# EasyEDA schematic SCH.json

## Sheets
1 CONNECTOR
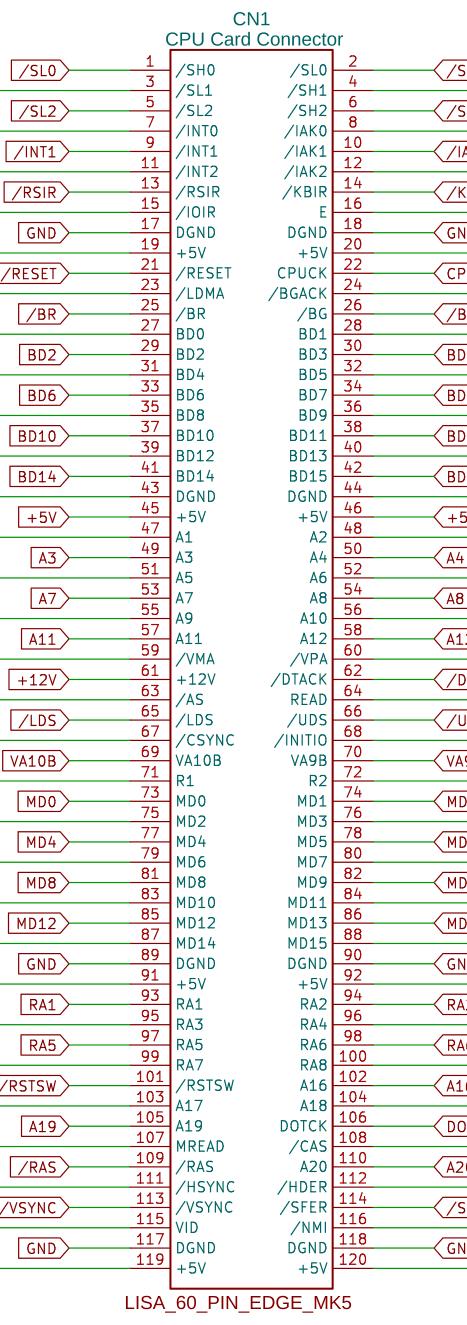
[diagram p0: CONNECTOR]
2 CPU
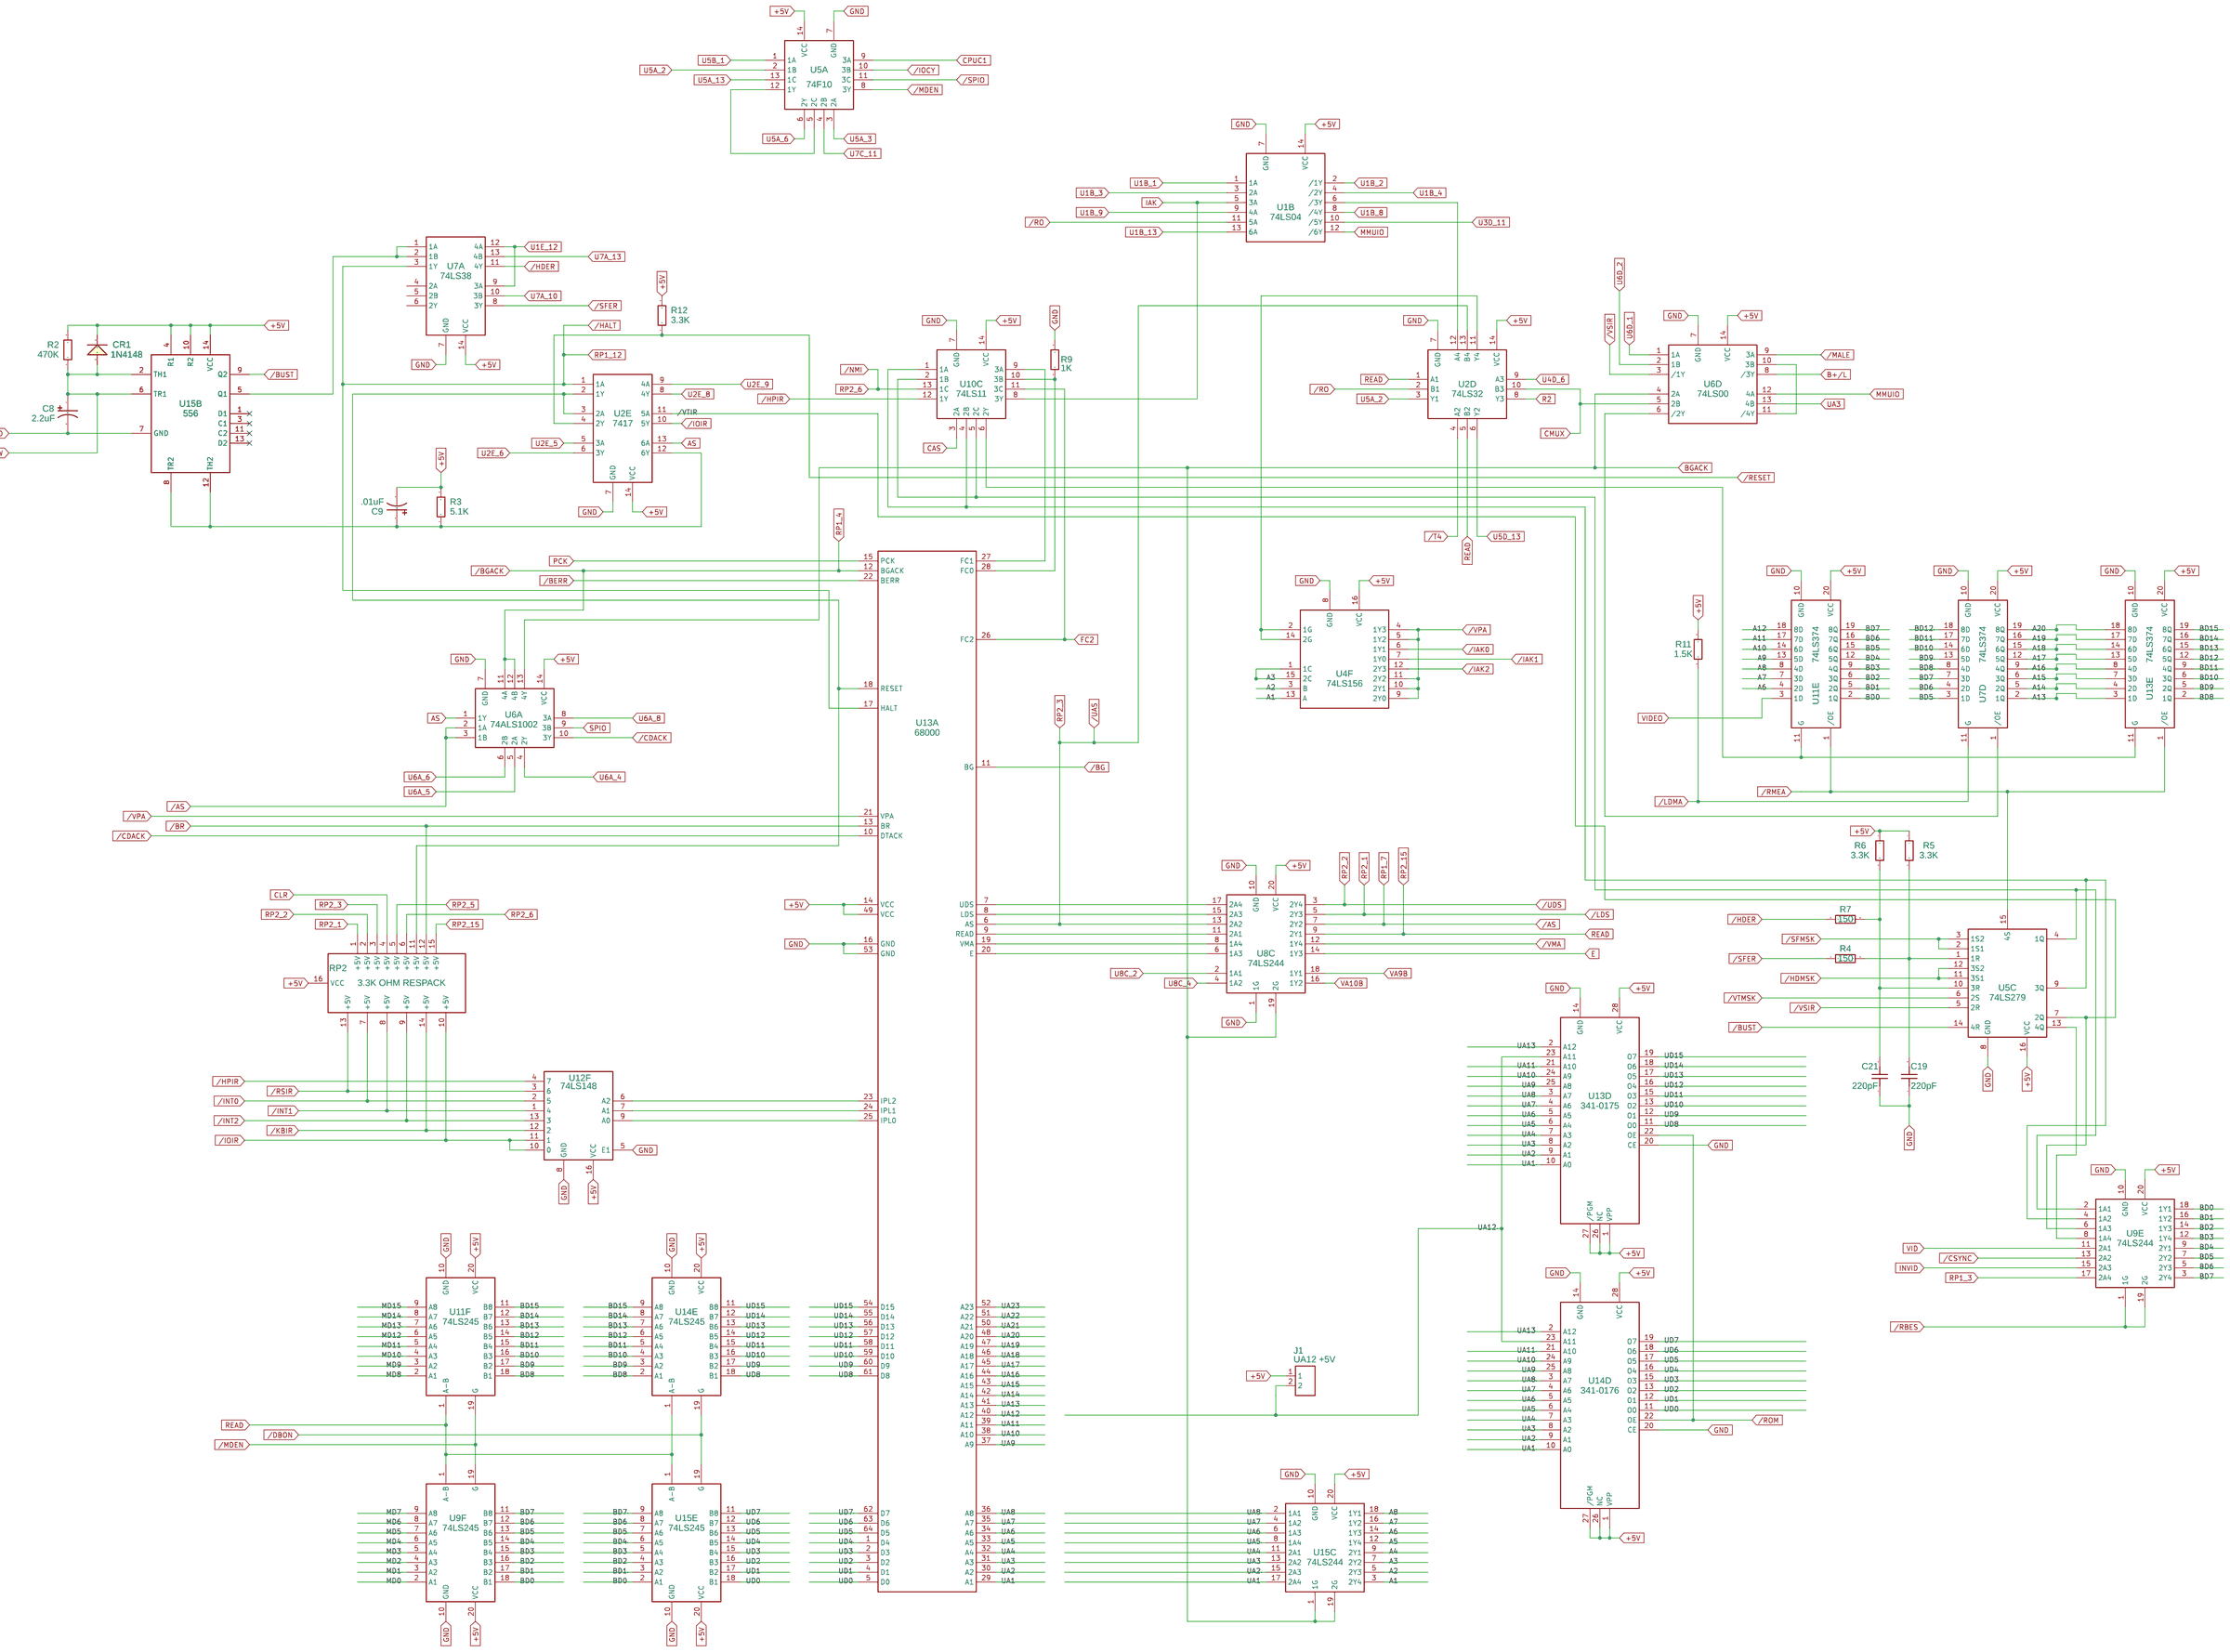
[diagram p1: CPU]
3 MMU
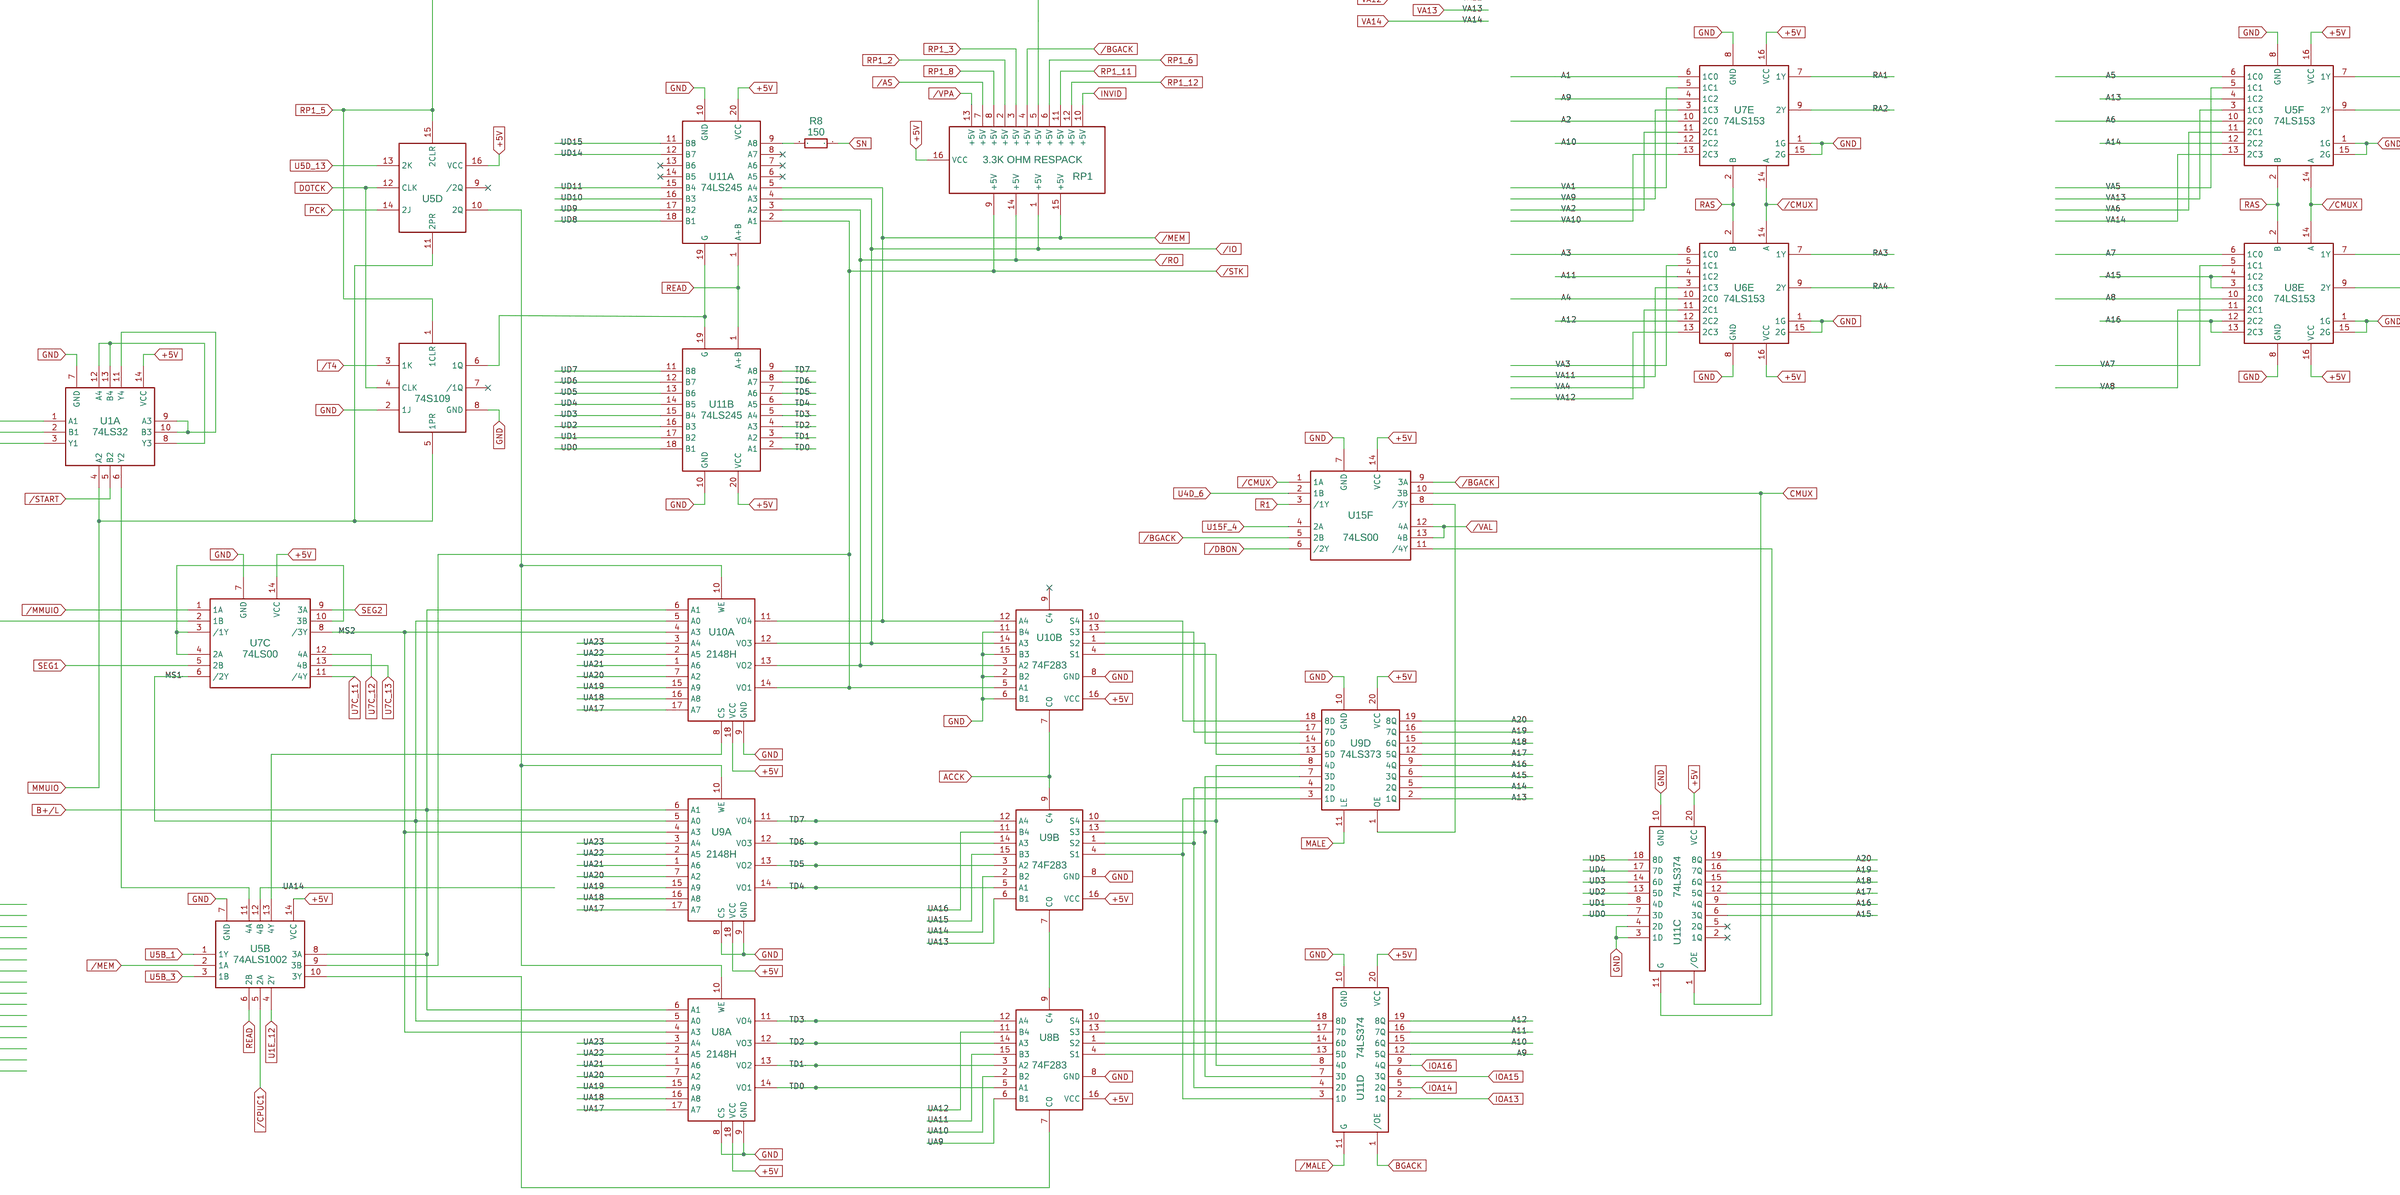
[diagram p2: MMU]
4 VIDEO
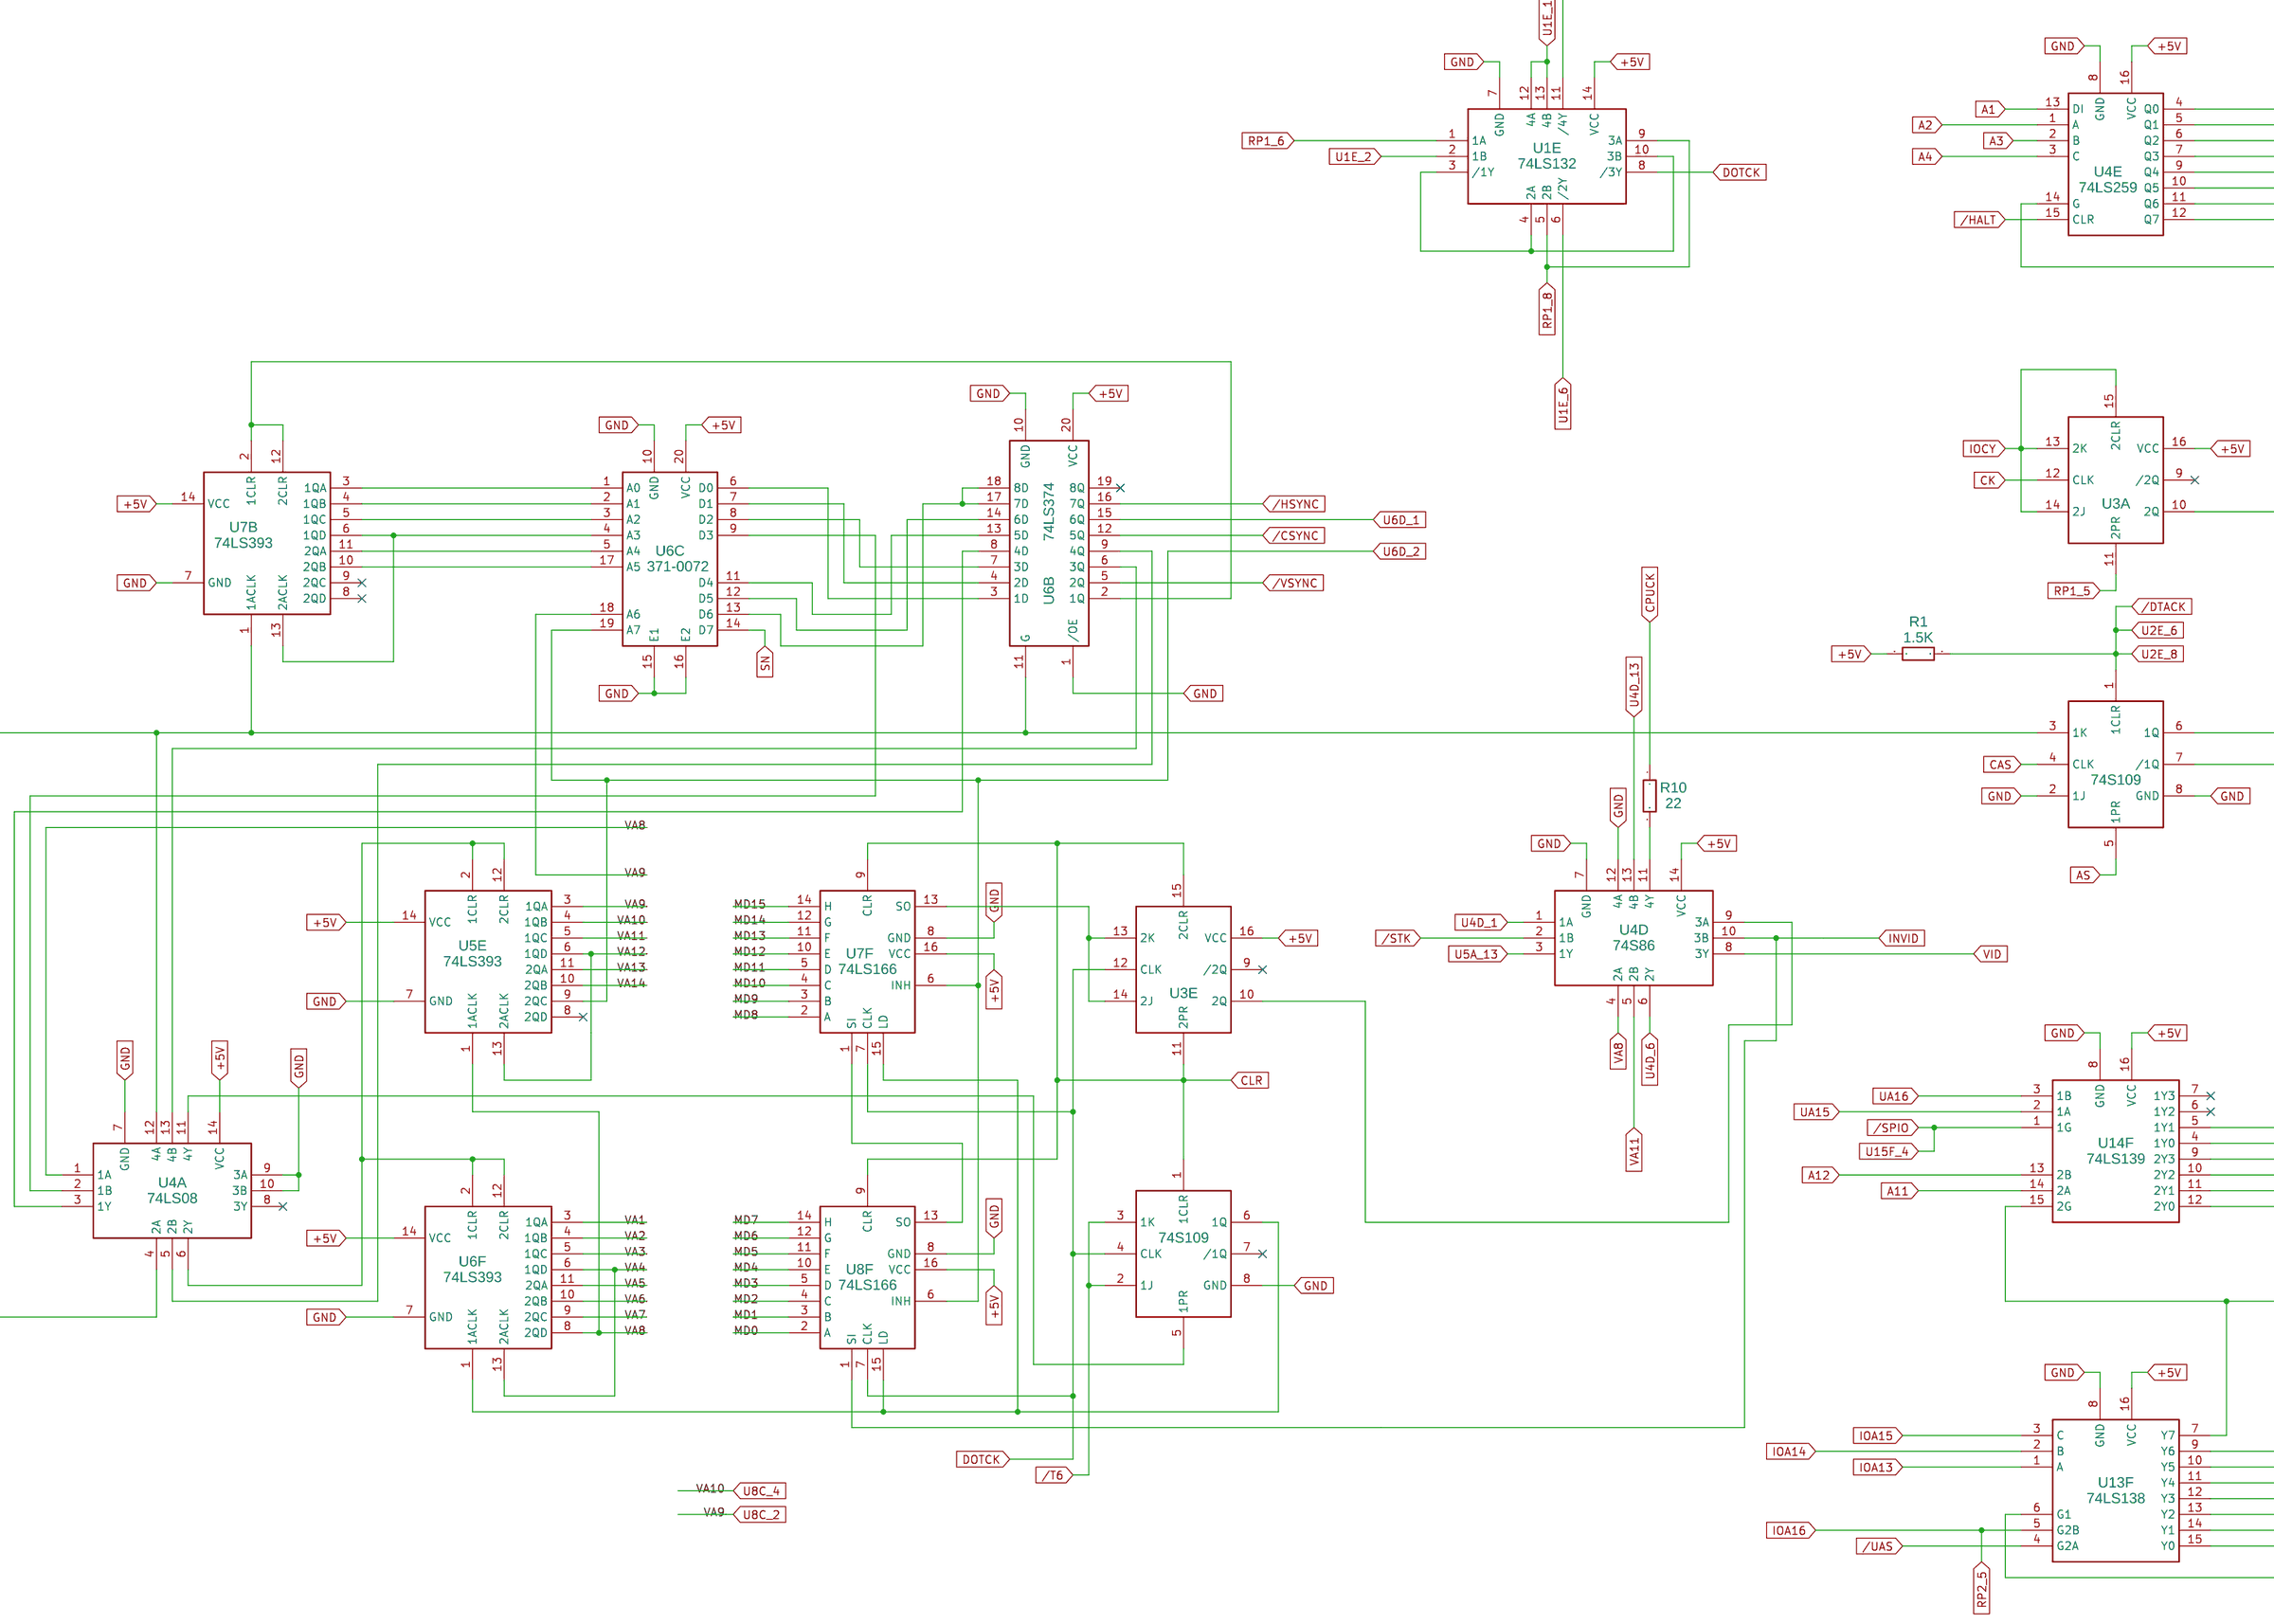
[diagram p3: VIDEO]
5 CLOCK+IO
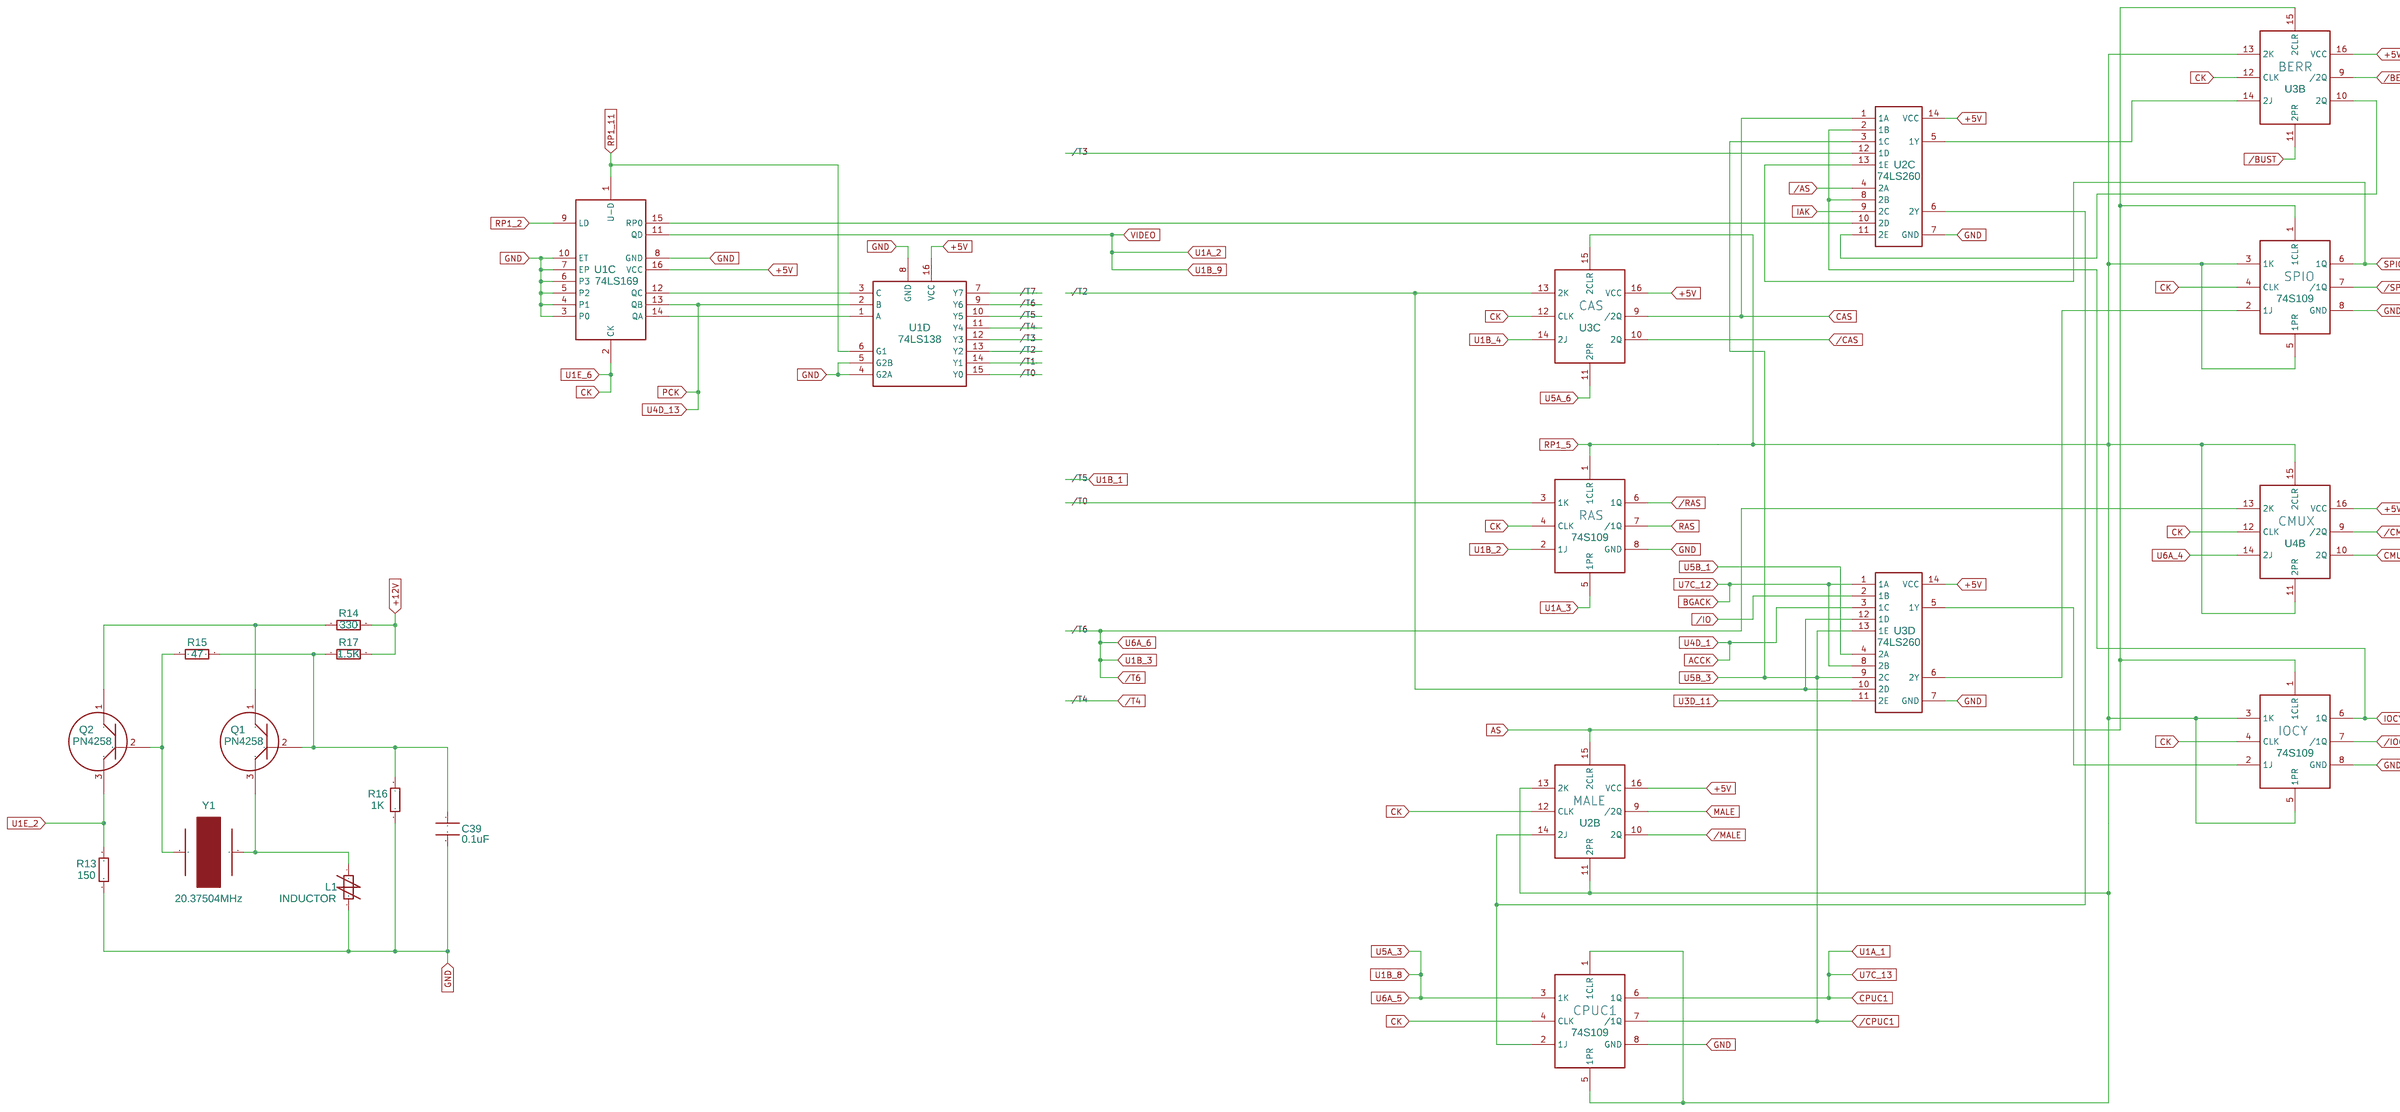
[diagram p4: CLOCK+IO]
6 MISC
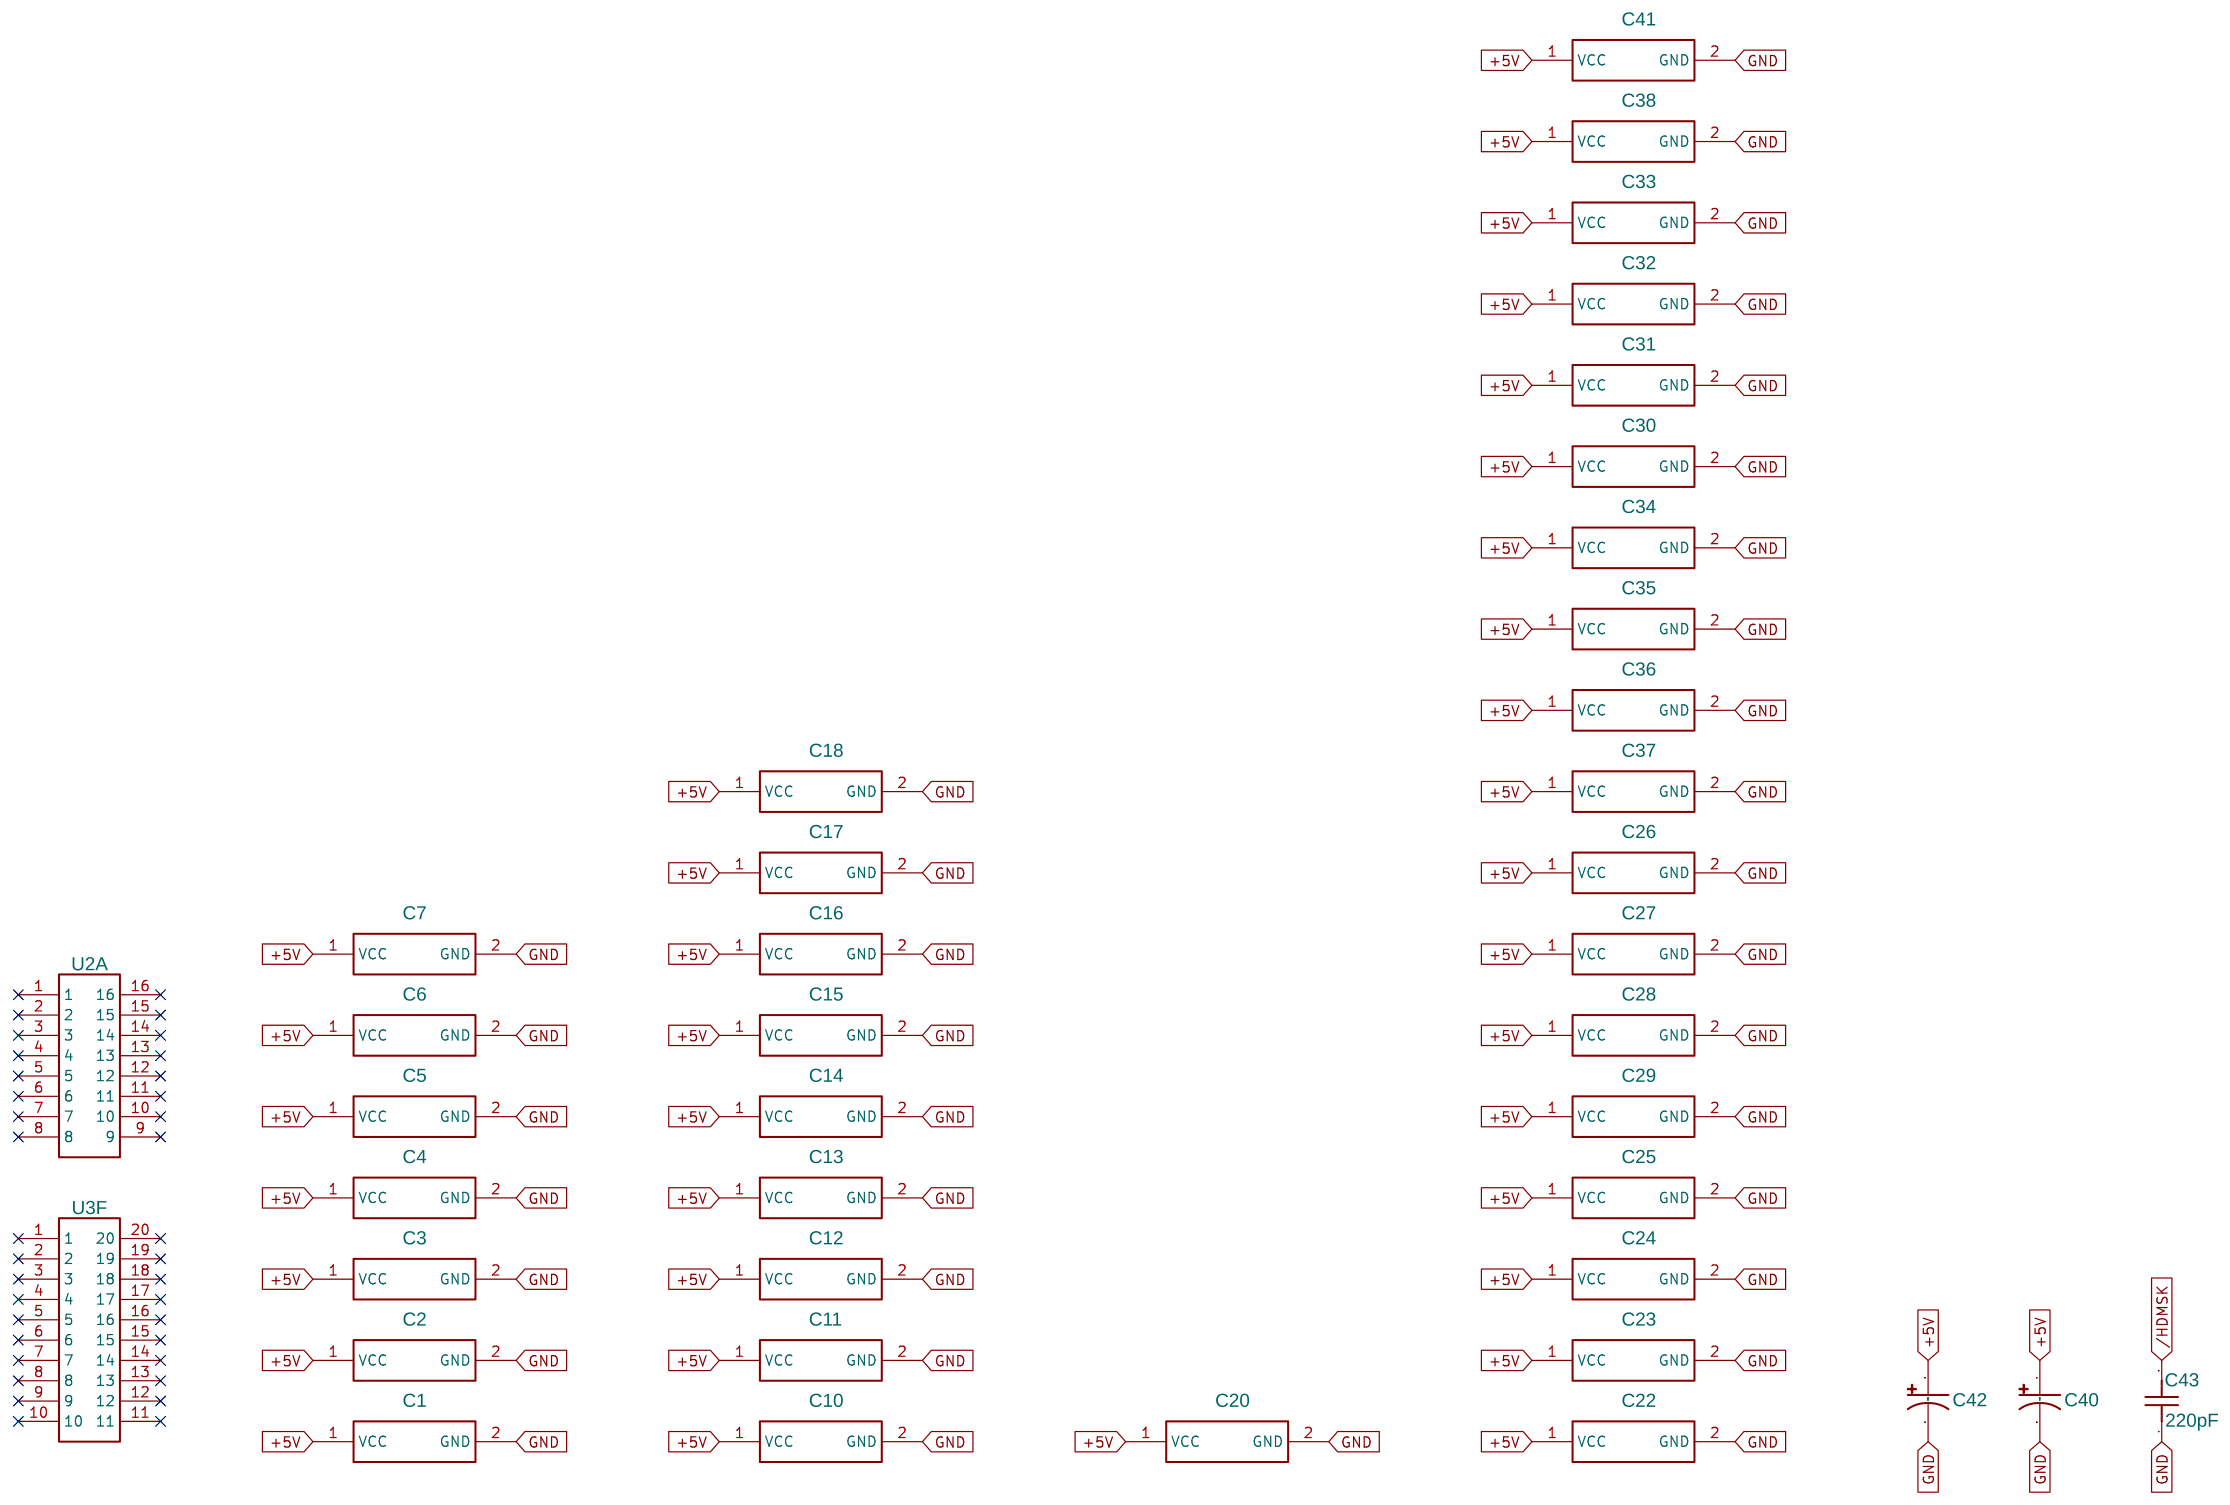
[diagram p5: MISC]

## Parts
sheet CLOCK+IO
C39  0.1uF  [LISA_RESISTOR]
L1  INDUCTOR  [LISA_RESISTOR]
Q1  PN4258  [LISA_CPU_TRANSISTOR]
Q2  PN4258  [LISA_CPU_TRANSISTOR]
R13  150  [LISA_RESISTOR]
R14  330  [LISA_RESISTOR]
R15  47  [LISA_RESISTOR]
R16  1K  [LISA_RESISTOR]
R17  1.5K  [LISA_RESISTOR]
U1C  74LS169  [LISA_DIP_16]
U1D  74LS138  [LISA_DIP_16]
U2B  74S109  [LISA_DIP_16]
U2C  74LS260  [LISA_DIP_14]
U3B  74S109  [LISA_DIP_16]
U3C  74S109  [LISA_DIP_16]
U3D  74LS260  [LISA_DIP_14]
U4B  74S109  [LISA_DIP_16]
Y1  20.37504MHz  [LISA_CPU_XTAL]
sheet CONNECTOR
CN1  CPU Card Connector  [LISA_60_PIN_EDGE_MK5]
sheet CPU
C8  2.2uF  [LISA_CPU_AXIAL_CAP]
C9  .01uF  [LISA_RESISTOR]
C19  220pF  [LISA_DISC_CERAMIC_CAPACITOR]
C21  220pF  [LISA_DISC_CERAMIC_CAPACITOR]
CR1  1N4148  [LISA_CPU_DIODE]
J1  UA12 +5V  [HDR-TH_2P-P2.54-V-M-1]
R2  470K  [LISA_RESISTOR]
R3  5.1K  [LISA_RESISTOR]
R4  150  [LISA_RESISTOR]
R5  3.3K  [LISA_RESISTOR]
R6  3.3K  [LISA_RESISTOR]
R7  150  [LISA_RESISTOR]
R9  1K  [LISA_RESISTOR]
R11  1.5K  [LISA_RESISTOR]
R12  3.3K  [LISA_RESISTOR]
RP2  3.3K OHM RESPACK  [LISA_DIP_16]
U1B  74LS04  [LISA_DIP_14]
U2D  74LS32  [LISA_DIP_14]
U2E  7417  [LISA_DIP_14]
U4F  74LS156  [LISA_DIP_16]
U5A  74F10  [LISA_DIP_14]
U5C  74LS279  [LISA_DIP_16]
U6A  74ALS1002  [LISA_DIP_14]
U6D  74LS00  [LISA_DIP_14]
U7A  74LS38  [LISA_DIP_14]
U7D  74LS374  [LISA_DIP_20]
U8C  74LS244  [LISA_DIP_20]
U9E  74LS244  [LISA_DIP_20]
U9F  74LS245  [LISA_DIP_20]
U10C  74LS11  [LISA_DIP_14]
U11E  74LS374  [LISA_DIP_20]
U11F  74LS245  [LISA_DIP_20]
U12F  74LS148  [LISA_DIP_16]
U13A  68000  [68000_LISA]
U13D  341-0175  [LISA_CPU_2764_EPROM]
U13E  74LS374  [LISA_DIP_20]
U14D  341-0176  [LISA_CPU_2764_EPROM]
U14E  74LS245  [LISA_DIP_20]
U15B  556  [LISA_DIP_14]
U15C  74LS244  [LISA_DIP_20]
U15E  74LS245  [LISA_DIP_20]
sheet MISC
C1  LISA_CPU_DECOUPLER_CERAMIC_CAP  [CERAMIC_CAP_LISA]
C2  LISA_CPU_DECOUPLER_CERAMIC_CAP  [CERAMIC_CAP_LISA]
C3  LISA_CPU_DECOUPLER_CERAMIC_CAP  [CERAMIC_CAP_LISA]
C4  LISA_CPU_DECOUPLER_CERAMIC_CAP  [CERAMIC_CAP_LISA]
C5  LISA_CPU_DECOUPLER_CERAMIC_CAP  [CERAMIC_CAP_LISA]
C6  LISA_CPU_DECOUPLER_CERAMIC_CAP  [CERAMIC_CAP_LISA]
C7  LISA_CPU_DECOUPLER_CERAMIC_CAP  [CERAMIC_CAP_LISA]
C10  LISA_CPU_DECOUPLER_CERAMIC_CAP  [CERAMIC_CAP_LISA]
C11  LISA_CPU_DECOUPLER_CERAMIC_CAP  [CERAMIC_CAP_LISA]
C12  LISA_CPU_DECOUPLER_CERAMIC_CAP  [CERAMIC_CAP_LISA]
C13  LISA_CPU_DECOUPLER_CERAMIC_CAP  [CERAMIC_CAP_LISA]
C14  LISA_CPU_DECOUPLER_CERAMIC_CAP  [CERAMIC_CAP_LISA]
C15  LISA_CPU_DECOUPLER_CERAMIC_CAP  [CERAMIC_CAP_LISA]
C16  LISA_CPU_DECOUPLER_CERAMIC_CAP  [CERAMIC_CAP_LISA]
C17  LISA_CPU_DECOUPLER_CERAMIC_CAP  [CERAMIC_CAP_LISA]
C18  LISA_CPU_DECOUPLER_CERAMIC_CAP  [CERAMIC_CAP_LISA]
C20  LISA_CPU_DECOUPLER_CERAMIC_CAP  [CERAMIC_CAP_LISA]
C22  LISA_CPU_DECOUPLER_CERAMIC_CAP  [CERAMIC_CAP_LISA]
C23  LISA_CPU_DECOUPLER_CERAMIC_CAP  [CERAMIC_CAP_LISA]
C24  LISA_CPU_DECOUPLER_CERAMIC_CAP  [CERAMIC_CAP_LISA]
C25  LISA_CPU_DECOUPLER_CERAMIC_CAP  [CERAMIC_CAP_LISA]
C26  LISA_CPU_DECOUPLER_CERAMIC_CAP  [CERAMIC_CAP_LISA]
C27  LISA_CPU_DECOUPLER_CERAMIC_CAP  [CERAMIC_CAP_LISA]
C28  LISA_CPU_DECOUPLER_CERAMIC_CAP  [CERAMIC_CAP_LISA]
C29  LISA_CPU_DECOUPLER_CERAMIC_CAP  [CERAMIC_CAP_LISA]
C30  LISA_CPU_DECOUPLER_CERAMIC_CAP  [CERAMIC_CAP_LISA]
C31  LISA_CPU_DECOUPLER_CERAMIC_CAP  [CERAMIC_CAP_LISA]
C32  LISA_CPU_DECOUPLER_CERAMIC_CAP  [CERAMIC_CAP_LISA]
C33  LISA_CPU_DECOUPLER_CERAMIC_CAP  [CERAMIC_CAP_LISA]
C34  LISA_CPU_DECOUPLER_CERAMIC_CAP  [CERAMIC_CAP_LISA]
C35  LISA_CPU_DECOUPLER_CERAMIC_CAP  [CERAMIC_CAP_LISA]
C36  LISA_CPU_DECOUPLER_CERAMIC_CAP  [CERAMIC_CAP_LISA]
C37  LISA_CPU_DECOUPLER_CERAMIC_CAP  [CERAMIC_CAP_LISA]
C38  LISA_CPU_DECOUPLER_CERAMIC_CAP  [CERAMIC_CAP_LISA]
C40  LISA_CPU_AXIAL_CAP  [LISA_CPU_AXIAL_CAP]
C41  LISA_CPU_DECOUPLER_CERAMIC_CAP  [CERAMIC_CAP_LISA]
C42  LISA_CPU_AXIAL_CAP  [LISA_CPU_AXIAL_CAP]
C43  220pF  [LISA_DISC_CERAMIC_CAPACITOR]
U2A  LISA_EMPTY_DIP_16  [LISA_DIP_16]
U3F  LISA_EMPTY_DIP_20  [LISA_DIP_20]
sheet MMU
R8  150  [LISA_RESISTOR]
RP1  3.3K OHM RESPACK  [LISA_DIP_16]
U1A  74LS32  [LISA_DIP_14]
U5B  74ALS1002  [LISA_DIP_14]
U5D  74S109  [LISA_DIP_16]
U5F  74LS153  [LISA_DIP_16]
U6E  74LS153  [LISA_DIP_16]
U7C  74LS00  [LISA_DIP_14]
U7E  74LS153  [LISA_DIP_16]
U8A  2148H  [LISA_DIP_18]
U8B  74F283  [LISA_DIP_16]
U8E  74LS153  [LISA_DIP_16]
U9A  2148H  [LISA_DIP_18]
U9B  74F283  [LISA_DIP_16]
U9D  74LS373  [LISA_DIP_20]
U10A  2148H  [LISA_DIP_18]
U10B  74F283  [LISA_DIP_16]
U11A  74LS245  [LISA_DIP_20]
U11B  74LS245  [LISA_DIP_20]
U11C  74LS374  [LISA_DIP_20]
U11D  74LS374  [LISA_DIP_20]
U15F  74LS00  [LISA_DIP_14]
sheet VIDEO
R1  1.5K  [LISA_RESISTOR]
R10  22  [LISA_RESISTOR]
U1E  74LS132  [LISA_DIP_14]
U3A  74S109  [LISA_DIP_16]
U3E  74S109  [LISA_DIP_16]
U4A  74LS08  [LISA_DIP_14]
U4D  74S86  [LISA_DIP_14]
U4E  74LS259  [LISA_DIP_16]
U5E  74LS393  [LISA_DIP_14]
U6B  74LS374  [LISA_DIP_20]
U6C  371-0072  [LISA_DIP_20]
U6F  74LS393  [LISA_DIP_14]
U7B  74LS393  [LISA_DIP_14]
U7F  74LS166  [LISA_DIP_16]
U8F  74LS166  [LISA_DIP_16]
U13F  74LS138  [LISA_DIP_16]
U14F  74LS139  [LISA_DIP_16]

## Library data of the parts
C39 = LISA_CPU_GLASS_CAP: Contributor: William Tooker
L1 = LISA_CPU_INDUCTOR: Contributor: William Tooker
Q1 Q2 = LISA_CPU_TRANSISTOR: Contributor: William Tooker
R1-R17 = LISA_CPU_RESISTOR: Contributor: William Tooker
U1C = LISA_CPU_74LS169: Contributor: William Tooker
U1D U13F = LISA_CPU_74LS138: Contributor: William Tooker
U2B U3A U3B U3C U3E U4B U5D = LISA_CPU_74S109: Contributor: William Tooker
U2C U3D = LISA_CPU_74LS260: Contributor: William Tooker
Y1 = LISA_CPU_XTAL: Contributor: William Tooker
CN1 = Lisa CPU Connector: Contributor: will_tooker; Package Display: Yes
C8 C9 C40 C42 = LISA_CPU_AXIAL_CAP: Contributor: William Tooker
C19 C21 = LISA_CPU_CERAMIC_CAP: Contributor: William Tooker
CR1 = LISA_CPU_DIODE: Contributor: William Tooker
J1 = JUMPER2: Supplier: LCSC; Supplier Part: C2940092; Manufacturer: null; Manufacturer Part: Jumper2; Contributor: William Tooker; JLCPCB Part Class: Extended Part
RP2 = LISA_CPU_RP2: Contributor: William Tooker
U1B = LISA_CPU_74LS04: Contributor: will_tooker
U1A U2D = LISA_CPU_74LS32: Contributor: William Tooker
U2E = LISA_CPU_7417: Contributor: William Tooker
U4F = LISA_CPU_74LS156: Contributor: William Tooker
U5A = LISA_CPU_74F10: Contributor: William Tooker
U5C = LISA_CPU_74LS279: Contributor: William Tooker
U5B U6A = LISA_CPU_74ALS1002: Contributor: William Tooker
U6D U7C U15F = LISA_CPU_74LS00: Contributor: William Tooker
U7A = LISA_CPU_74LS38: Contributor: William Tooker
U6B U7D U11C U11D U11E U13E = LISA_CPU_74LS374: Contributor: William Tooker
U8C = LISA_CPU_74LS244_CTL: Contributor: William Tooker
U9E U15C = LISA_CPU_74LS244: Contributor: William Tooker
U9F U15E = LISA_CPU_74LS245_LOWER: Contributor: William Tooker
U10C = LISA_CPU_74LS11: Contributor: William Tooker
U11F U14E = LISA_CPU_74LS245_UPPER: Contributor: William Tooker
U12F = LISA_CPU_74LS148: Contributor: William Tooker
U13A = 68000 (LISA): Contributor: William Tooker
U13D U14D = LISA_CPU_EPROM: Contributor: William Tooker
U15B = LISA_CPU_556: Contributor: William Tooker
C1-C7 C10-C18 C20 C22-C38 C41 = LISA_CPU_DECOUPLER_CERAMIC_CAP: Contributor: William Tooker
C43 = LISA_CPU_CERAMIC_CAP: Contributor: William Tooker; Package Display: No
U2A = LISA_EMPTY_DIP_16: Contributor: William Tooker
U3F = LISA_EMPTY_DIP_20: Contributor: William Tooker
RP1 = LISA_CPU_RP1: Contributor: William Tooker
U5F U7E = LISA_CPU_74LS153_UPPER: Contributor: William Tooker
U6E U8E = LISA_CPU_74LS153_LOWER: Contributor: William Tooker
U8A U9A U10A = LISA_CPU_2148H: Contributor: William Tooker
U8B U9B U10B = LISA_CPU_74F283: Contributor: will_tooker
U9D = LISA_CPU_74LS373: Contributor: William Tooker
U11A = LISA_CPU_74LS245_U11A: Contributor: will_tooker
U11B = LISA_CPU_74LS245_U11B: Contributor: William Tooker
U1E = LISA_CPU_74LS132: Contributor: William Tooker
U4A = LISA_CPU_74LS08: Contributor: William Tooker
U4D = LISA_CPU_74S86: Contributor: William Tooker
U4E = LISA_CPU_74LS259: Contributor: William Tooker
U5E U6F U7B = LISA_CPU_74LS393: Contributor: William Tooker
U6C = LISA_CPU_371-0072_VIDEO_ROM: Contributor: William Tooker
U7F U8F = LISA_CPU_74LS166: Contributor: William Tooker
U14F = LISA_CPU_74LS139: Contributor: William Tooker

## Nets
+5V: C1.1(VCC) C2.1(VCC) C3.1(VCC) C4.1(VCC) C5.1(VCC) C6.1(VCC) C7.1(VCC) C9.2 C10.1(VCC) C11.1(VCC) C12.1(VCC) C13.1(VCC) C14.1(VCC) C15.1(VCC) C16.1(VCC) C17.1(VCC) C18.1(VCC) C20.1(VCC) C22.1(VCC) C23.1(VCC) C24.1(VCC) C25.1(VCC) C26.1(VCC) C27.1(VCC) C28.1(VCC) C29.1(VCC) C30.1(VCC) C31.1(VCC) C32.1(VCC) C33.1(VCC) C34.1(VCC) C35.1(VCC) C36.1(VCC) C37.1(VCC) C38.1(VCC) C40.1 C41.1(VCC) C42.1 CN1.19(+5V) CN1.20(+5V) CN1.45(+5V) CN1.46(+5V) CN1.91(+5V) CN1.92(+5V) CN1.119(+5V) CN1.120(+5V) CR1.2 J1.1 R1.2 R2.2 R3.2 R5.1 R6.1 R11.1 R12.2 RP1.16(VCC) RP2.16(VCC) U1A.14(VCC) U1B.14(VCC) U1C.16(VCC) U1D.16(VCC) U1E.14(VCC) U2B.16(VCC) U2C.14(VCC) U2D.14(VCC) U2E.14(VCC) U3A.16(VCC) U3B.16(VCC) U3C.16(VCC) U3D.14(VCC) U3E.16(VCC) U4A.14(VCC) U4B.16(VCC) U4D.14(VCC) U4E.16(VCC) U4F.16(VCC) U5A.14(VCC) U5B.14(VCC) U5C.16(VCC) U5D.16(VCC) U5E.14(VCC) U5F.16(VCC) U6A.14(VCC) U6B.20(VCC) U6C.20(VCC) U6D.14(VCC) U6E.16(VCC) U6F.14(VCC) U7A.14(VCC) U7B.14(VCC) U7C.14(VCC) U7D.20(VCC) U7E.16(VCC) U7F.16(VCC) U8A.18(VCC) U8B.16(VCC) U8C.20(VCC) U8E.16(VCC) U8F.16(VCC) U9A.18(VCC) U9B.16(VCC) U9D.20(VCC) U9E.20(VCC) U9F.20(VCC) U10A.18(VCC) U10B.16(VCC) U10C.14(VCC) U11A.20(VCC) U11B.20(VCC) U11C.20(VCC) U11D.20(VCC) U11E.20(VCC) U11F.20(VCC) U12F.16(VCC) U13A.14(VCC) U13A.49(VCC) U13D.1(VPP) U13D.26(NC) U13D.27(/PGM) U13D.28(VCC) U13E.20(VCC) U13F.16(VCC) U14D.1(VPP) U14D.26(NC) U14D.27(/PGM) U14D.28(VCC) U14E.20(VCC) U14F.16(VCC) U15B.4(R1) U15B.10(R2) U15B.14(VCC) U15C.20(VCC) U15E.20(VCC) U15F.14(VCC)
+12V: CN1.61(+12V) R14.2 R17.2
GND: C1.2(GND) C2.2(GND) C3.2(GND) C4.2(GND) C5.2(GND) C6.2(GND) C7.2(GND) C8.2 C10.2(GND) C11.2(GND) C12.2(GND) C13.2(GND) C14.2(GND) C15.2(GND) C16.2(GND) C17.2(GND) C18.2(GND) C19.1 C20.2(GND) C21.1 C22.2(GND) C23.2(GND) C24.2(GND) C25.2(GND) C26.2(GND) C27.2(GND) C28.2(GND) C29.2(GND) C30.2(GND) C31.2(GND) C32.2(GND) C33.2(GND) C34.2(GND) C35.2(GND) C36.2(GND) C37.2(GND) C38.2(GND) C39.2 C40.2 C41.2(GND) C42.2 C43.1 CN1.17(DGND) CN1.18(DGND) CN1.43(DGND) CN1.44(DGND) CN1.89(DGND) CN1.90(DGND) CN1.117(DGND) CN1.118(DGND) L1.2 R9.1 R13.1 R16.1 U1A.7(GND) U1B.7(GND) U1C.3(P0) U1C.4(P1) U1C.5(P2) U1C.6(P3) U1C.7(EP) U1C.8(GND) U1C.10(ET) U1D.4(G2A) U1D.5(G2B) U1D.8(GND) U1E.7(GND) U2B.8(GND) U2C.7(GND) U2D.7(GND) U2E.7(GND) U3A.2(1J) U3A.8(GND) U3B.8(GND) U3C.8(GND) U3D.7(GND) U3E.8(GND) U4A.7(GND) U4A.9(3A) U4A.10(3B) U4B.8(GND) U4D.7(GND) U4D.12(4A) U4E.8(GND) U4F.8(GND) U5A.7(GND) U5B.7(GND) U5C.8(GND) U5D.2(1J) U5D.8(GND) U5E.7(GND) U5F.1(1G) U5F.8(GND) U5F.15(2G) U6A.7(GND) U6B.1(/OE) U6B.10(GND) U6C.10(GND) U6C.15(E1) U6C.16(E2) U6D.7(GND) U6E.1(1G) U6E.8(GND) U6E.15(2G) U6F.7(GND) U7A.7(GND) U7B.7(GND) U7C.7(GND) U7D.10(GND) U7E.1(1G) U7E.8(GND) U7E.15(2G) U7F.8(GND) U8A.8(CS) U8A.9(GND) U8B.8(GND) U8C.1(1G) U8C.10(GND) U8E.1(1G) U8E.8(GND) U8E.15(2G) U8F.8(GND) U9A.8(CS) U9A.9(GND) U9B.8(GND) U9D.10(GND) U9E.10(GND) U9F.10(GND) U10A.9(GND) U10B.2(B2) U10B.6(B1) U10B.8(GND) U10B.11(B4) U10B.15(B3) U10C.7(GND) U11A.10(GND) U11B.10(GND) U11C.3(1D) U11C.4(2D) U11C.10(GND) U11D.10(GND) U11E.10(GND) U11F.10(GND) U12F.5(E1) U12F.8(GND) U13A.16(GND) U13A.53(GND) U13D.14(GND) U13D.20(CE) U13E.10(GND) U13F.8(GND) U14D.14(GND) U14D.20(CE) U14E.10(GND) U14F.8(GND) U15B.7(GND) U15C.10(GND) U15E.10(GND) U15F.7(GND)
/AS: CN1.63(/AS) RP1.7(+5V) U2C.4(2A) U6A.2(1A) U6A.3(1B) U8C.7(2Y2)
/BERR: U3B.9(/2Q) U13A.22(BERR)
/BG: CN1.26(/BG) U13A.11(BG)
/BGACK: CN1.24(/BGACK) RP1.4(+5V) U6A.11(4A) U6A.12(4B) U13A.12(BGACK) U15F.5(2B) U15F.9(3A)
/BR: CN1.25(/BR) RP2.12(+5V) U13A.13(BR)
/BUST: U3B.11(2PR) U5C.14(4R) U15B.9(Q2)
/CAS: CN1.108(/CAS) U3C.10(2Q)
/CDACK: U6A.10(3Y) U13A.10(DTACK)
/CMUX: U4B.9(/2Q) U5F.14(A) U6E.14(A) U7E.14(A) U8E.14(A) U15F.1(1A)
/CPUC1: U2B.7(/1Q) U2C.3(1C) U3D.9(2C) U3D.13(1E) U5B.3(1B) U5B.5(2A)
/CSYNC: CN1.67(/CSYNC) U6B.12(5Q) U9E.13(2A2)
/DBON: U14E.19(G) U15E.19(G) U15F.6(/2Y)
/DTACK: CN1.62(/DTACK) R1.1 U2E.6(3Y) U2E.8(4Y) U3A.1(1CLR)
/HALT: RP1.12(+5V) U2E.1(1A) U4E.15(CLR) U7A.3(1Y) U13A.17(HALT)
/HDER: CN1.112(/HDER) R7.1 U7A.11(4Y)
/HDMSK: C43.2 U4E.12(Q7) U5C.11(3S1) U5C.12(3S2)
/HPIR: U10C.12(1Y) U12F.4(7)
/HSYNC: CN1.111(/HSYNC) U6B.16(7Q)
/IAK0: CN1.8(/IAK0) U4F.6(1Y1)
/IAK1: CN1.10(/IAK1) U4F.7(1Y0)
/IAK2: CN1.12(/IAK2) U4F.12(2Y3)
/INITIO: CN1.68(/INITIO) U13F.9(Y6)
/INT0: CN1.7(/INT0) RP2.7(+5V) U12F.2(5)
/INT1: CN1.9(/INT1) RP2.8(+5V) U12F.1(4)
/INT2: CN1.11(/INT2) RP2.9(+5V) U12F.13(3)
/IO: RP1.1(+5V) U3D.2(1B) U10A.12(VO3) U10B.14(A3) U11A.4(A3)
/IOCY: U4B.7(/1Q) U5A.10(3B)
/IOIR: CN1.15(/IOIR) RP2.10(+5V) U2E.10(5Y) U12F.10(0) U12F.11(1)
/KBIR: CN1.14(/KBIR) RP2.14(+5V) U12F.12(2)
/LDMA: CN1.23(/LDMA) R11.2 U7D.11(G)
/LDS: CN1.65(/LDS) RP2.1(+5V) U8C.5(2Y3)
/MALE: U2B.10(2Q) U6D.9(3A) U11D.11(G)
/MDEN: U5A.8(3Y) U9F.19(G) U11F.19(G)
/MEM: RP1.15(+5V) U5B.2(1A) U10A.11(VO4) U10B.12(A4) U11A.5(A4)
/MMUIO: U1B.13(6A) U7C.1(1A) U14F.5(1Y1)
/NMI: CN1.116(/NMI) RP2.6(+5V) U10C.13(1C)
/RAS: CN1.109(/RAS) U3C.6(1Q)
/RBES: U9E.1(1G) U9E.19(2G) U14F.9(2Y3)
/RESET: CN1.21(/RESET) R12.1 U2E.4(2Y)
/RMEA: U5C.15(4S) U11E.1(/OE) U13E.1(/OE) U14F.10(2Y2)
/RO: RP1.14(+5V) U1B.11(5A) U2D.2(B1) U10A.13(VO2) U10B.3(A2) U11A.3(A2)
/ROM: U13D.22(OE) U14D.22(OE) U14F.4(1Y0)
/RSIR: CN1.13(/RSIR) RP2.13(+5V) U12F.3(6)
/RSTSW: C8.1 CN1.101(/RSTSW) CR1.1 R2.1 U15B.2(TH1) U15B.6(TR1)
/SFER: CN1.114(/SFER) R4.1 U7A.8(3Y)
/SFMSK: U4E.10(Q5) U5C.2(1S1) U5C.3(1S2)
/SH0: CN1.2(/SL0) U13F.14(Y1)
/SH1: CN1.4(/SH1) U13F.12(Y3)
/SH2: CN1.6(/SH2) U13F.10(Y5)
/SL0: CN1.1(/SH0) U13F.15(Y0)
/SL1: CN1.3(/SL1) U13F.13(Y2)
/SL2: CN1.5(/SL2) U13F.11(Y4)
/SPIO: U3B.7(/1Q) U5A.11(3C) U14F.1(1G) U15F.4(2A)
/START: U1A.5(B2) U4E.9(Q4)
/STK: RP1.9(+5V) U4D.2(1B) U5B.9(3B) U10A.14(VO1) U10B.5(A1) U11A.2(A1)
/T0: U1D.15(Y0) U3C.3(1K)
/T1: U1D.14(Y1)
/T2: U1D.13(Y2) U3C.13(2K) U3D.10(2D) U3D.12(1D)
/T3: U1D.12(Y3) U2C.12(1D)
/T4: U1D.11(Y4) U2D.4(A2) U5D.3(1K)
/T5: U1B.1(1A) U1D.10(Y5)
/T6: U1B.3(2A) U1D.9(Y6) U3E.2(1J) U3E.3(1K) U4B.13(2K) U6A.6(2B)
/T7: U1D.7(Y7)
/UAS: RP2.3(+5V) U2D.13(B4) U8C.13(2A2) U13A.6(AS) U13F.4(G2A)
/UDS: CN1.66(/UDS) RP2.2(+5V) U8C.3(2Y4)
/VAL: U14F.11(2Y1) U15F.12(4A) U15F.13(4B)
/VMA: CN1.59(/VMA) U8C.12(1Y4)
/VPA: CN1.60(/VPA) RP1.13(+5V) U4F.4(1Y3) U4F.5(1Y2) U4F.9(2Y0) U4F.10(2Y1) U4F.11(2Y2) U13A.21(VPA)
/VSIR: U5C.5(2R) U6D.3(/1Y)
/VSYNC: CN1.113(/VSYNC) U6B.5(2Q)
/VTIR: U2E.11(5A) U5C.7(2Q) U9E.6(1A3)
/VTMSK: U4E.11(Q6) U5C.6(2S)
A1: CN1.47(A1) U4E.13(DI) U4F.13(A) U7E.6(1C0) U15C.3(2Y4)
A2: CN1.48(A2) U4E.1(A) U4F.3(B) U7E.10(2C0) U15C.5(2Y3)
A3: CN1.49(A3) U4E.2(B) U4F.1(1C) U4F.15(2C) U6E.6(1C0) U15C.7(2Y2)
A4: CN1.50(A4) U4E.3(C) U6E.10(2C0) U15C.9(2Y1)
A5: CN1.51(A5) U5F.6(1C0) U15C.12(1Y4)
A6: CN1.52(A6) U5F.10(2C0) U11E.4(2D) U15C.14(1Y3)
A7: CN1.53(A7) U8E.6(1C0) U11E.7(3D) U15C.16(1Y2)
A8: CN1.54(A8) U8E.10(2C0) U11E.8(4D) U15C.18(1Y1)
A9: CN1.55(A9) U7E.4(1C2) U11D.12(5Q) U11E.13(5D)
A10: CN1.56(A10) U7E.12(2C2) U11D.15(6Q) U11E.14(6D)
A11: CN1.57(A11) U6E.4(1C2) U11D.16(7Q) U11E.17(7D) U14F.14(2A)
A12: CN1.58(A12) U6E.12(2C2) U11D.19(8Q) U11E.18(8D) U14F.13(2B)
A13: U5F.4(1C2) U7D.2(1Q) U9D.2(1Q) U13E.3(1D)
A14: U5F.12(2C2) U7D.5(2Q) U9D.5(2Q) U13E.4(2D)
A15: U7D.6(3Q) U8E.3(1C3) U8E.4(1C2) U9D.6(3Q) U11C.6(3Q) U13E.7(3D)
A16: CN1.102(A16) U7D.9(4Q) U8E.12(2C2) U8E.13(2C3) U9D.9(4Q) U11C.9(4Q) U13E.8(4D)
A17: CN1.103(A17) U7D.12(5Q) U9D.12(5Q) U11C.12(5Q) U13E.13(5D)
A18: CN1.104(A18) U7D.15(6Q) U9D.15(6Q) U11C.15(6Q) U13E.14(6D)
A19: CN1.105(A19) U7D.16(7Q) U9D.16(7Q) U11C.16(7Q) U13E.17(7D)
A20: CN1.110(A20) U7D.19(8Q) U9D.19(8Q) U11C.19(8Q) U13E.18(8D)
ACCK: U3D.3(1C) U4D.1(1A) U9B.9(C4) U10B.7(C0)
AS: U2B.15(2CLR) U2E.13(6A) U3A.5(1PR) U3B.1(1CLR) U3B.15(2CLR) U4B.1(1CLR) U6A.1(1Y)
B+/L: U5B.8(3A) U6D.8(/3Y) U8A.6(A1) U9A.6(A1) U10A.6(A1)
BD0: CN1.27(BD0) U9E.18(1Y1) U9F.18(B1) U11E.2(1Q) U15E.2(A1)
BD1: CN1.28(BD1) U9E.16(1Y2) U9F.17(B2) U11E.5(2Q) U15E.3(A2)
BD2: CN1.29(BD2) U9E.14(1Y3) U9F.16(B3) U11E.6(3Q) U15E.4(A3)
BD3: CN1.30(BD3) U9E.12(1Y4) U9F.15(B4) U11E.9(4Q) U15E.5(A4)
BD4: CN1.31(BD4) U9E.9(2Y1) U9F.14(B5) U11E.12(5Q) U15E.6(A5)
BD5: CN1.32(BD5) U7D.3(1D) U9E.7(2Y2) U9F.13(B6) U11E.15(6Q) U15E.7(A6)
BD6: CN1.33(BD6) U7D.4(2D) U9E.5(2Y3) U9F.12(B7) U11E.16(7Q) U15E.8(A7)
BD7: CN1.34(BD7) U7D.7(3D) U9E.3(2Y4) U9F.11(B8) U11E.19(8Q) U15E.9(A8)
BD8: CN1.35(BD8) U7D.8(4D) U11F.18(B1) U13E.2(1Q) U14E.2(A1)
BD9: CN1.36(BD9) U7D.13(5D) U11F.17(B2) U13E.5(2Q) U14E.3(A2)
BD10: CN1.37(BD10) U7D.14(6D) U11F.16(B3) U13E.6(3Q) U14E.4(A3)
BD11: CN1.38(BD11) U7D.17(7D) U11F.15(B4) U13E.9(4Q) U14E.5(A4)
BD12: CN1.39(BD12) U7D.18(8D) U11F.14(B5) U13E.12(5Q) U14E.6(A5)
BD13: CN1.40(BD13) U11F.13(B6) U13E.15(6Q) U14E.7(A6)
BD14: CN1.41(BD14) U11F.12(B7) U13E.16(7Q) U14E.8(A7)
BD15: CN1.42(BD15) U11F.11(B8) U13E.19(8Q) U14E.9(A8)
BGACK: U3D.1(1A) U3D.8(2B) U6A.13(4Y) U6D.4(2A) U7C.12(4A) U8C.19(2G) U11D.1(/OE) U15C.1(1G) U15C.19(2G)
CAS: U2C.1(1A) U3A.4(CLK) U3C.9(/2Q) U10C.3(2A)
CK: U1C.2(CK) U1E.6(/2Y) U2B.4(CLK) U2B.12(CLK) U3A.12(CLK) U3B.4(CLK) U3B.12(CLK) U3C.4(CLK) U3C.12(CLK) U4B.4(CLK) U4B.12(CLK)
CLR: RP2.4(+5V) U3E.1(1CLR) U3E.11(2PR) U3E.15(2CLR) U7F.9(CLR) U8F.9(CLR)
CMUX: U2D.10(B3) U4A.4(2A) U4B.10(2Q) U6D.5(2B) U11C.1(/OE) U15F.10(3B)
CPUC1: U1A.1(A1) U2B.6(1Q) U5A.9(3A) U7C.13(4B)
CPUCK: CN1.22(CPUCK) R10.1
DOTCK: CN1.106(DOTCK) U1E.8(/3Y) U3E.4(CLK) U3E.12(CLK) U5D.4(CLK) U5D.12(CLK) U7F.7(CLK) U8F.7(CLK)
E: CN1.16(E) U8C.14(1Y3)
FC2: U7C.2(1B) U10C.11(3C) U13A.26(FC2)
IAK: U1B.5(3A) U2C.9(2C) U10C.8(3Y)
INVID: RP1.10(+5V) U4D.10(3B) U8F.1(SI) U9E.15(2A3)
IOA13: U11D.2(1Q) U13F.1(A)
IOA14: U11D.5(2Q) U13F.2(B)
IOA15: U11D.6(3Q) U13F.3(C)
IOA16: RP2.5(+5V) U11D.9(4Q) U13F.5(G2B)
IOCY: U2C.2(1B) U2C.8(2B) U3A.13(2K) U3A.14(2J) U3A.15(2CLR) U4B.6(1Q)
MALE: U2B.9(/2Q) U9D.11(LE)
MD0: CN1.73(MD0) U8F.2(A) U9F.2(A1)
MD1: CN1.74(MD1) U8F.3(B) U9F.3(A2)
MD2: CN1.75(MD2) U8F.4(C) U9F.4(A3)
MD3: CN1.76(MD3) U8F.5(D) U9F.5(A4)
MD4: CN1.77(MD4) U8F.10(E) U9F.6(A5)
MD5: CN1.78(MD5) U8F.11(F) U9F.7(A6)
MD6: CN1.79(MD6) U8F.12(G) U9F.8(A7)
MD7: CN1.80(MD7) U8F.14(H) U9F.9(A8)
MD8: CN1.81(MD8) U7F.2(A) U11F.2(A1)
MD9: CN1.82(MD9) U7F.3(B) U11F.3(A2)
MD10: CN1.83(MD10) U7F.4(C) U11F.4(A3)
MD11: CN1.84(MD11) U7F.5(D) U11F.5(A4)
MD12: CN1.85(MD12) U7F.10(E) U11F.6(A5)
MD13: CN1.86(MD13) U7F.11(F) U11F.7(A6)
MD14: CN1.87(MD14) U7F.12(G) U11F.8(A7)
MD15: CN1.88(MD15) U7F.14(H) U11F.9(A8)
MMUIO: U1A.4(A2) U1B.12(/6Y) U5D.5(1PR) U5D.11(2PR) U6D.12(4A)
MREAD: CN1.107(MREAD) U1E.11(/4Y)
MS1: U7C.6(/2Y) U8A.5(A0) U9A.5(A0) U10A.5(A0)
MS2: U7C.8(/3Y) U8A.4(A3) U9A.4(A3) U10A.4(A3)
PCK: U1C.13(QB) U1D.2(B) U4D.13(4B) U5D.14(2J) U13A.15(PCK)
R1: CN1.71(R1) U15F.3(/1Y)
R2: CN1.72(R2) U2D.8(Y3)
RA1: CN1.93(RA1) U7E.7(1Y)
RA2: CN1.94(RA2) U7E.9(2Y)
RA3: CN1.95(RA3) U6E.7(1Y)
RA4: CN1.96(RA4) U6E.9(2Y)
RA5: CN1.97(RA5) U5F.7(1Y)
RA6: CN1.98(RA6) U5F.9(2Y)
RA7: CN1.99(RA7) U8E.7(1Y)
RA8: CN1.100(RA8) U8E.9(2Y)
RAS: U3C.7(/1Q) U5F.2(B) U6E.2(B) U7E.2(B) U8E.2(B)
READ: CN1.64(READ) RP2.15(+5V) U2D.1(A1) U2D.5(B2) U5B.6(2B) U8C.9(2Y1) U9F.1(A-B) U11A.1(A+B) U11B.1(A+B) U11F.1(A-B) U14E.1(A-B) U15E.1(A-B)
RP1_2: RP1.2(+5V) U1C.9(LD)
RP1_3: RP1.3(+5V) U9E.17(2A4)
RP1_5: RP1.5(+5V) U2B.1(1CLR) U2B.5(1PR) U2B.11(2PR) U2B.13(2K) U3A.11(2PR) U3B.3(1K) U3B.5(1PR) U3B.13(2K) U3C.1(1CLR) U3C.15(2CLR) U4B.3(1K) U4B.5(1PR) U4B.11(2PR) U4B.15(2CLR) U5D.1(1CLR) U5D.15(2CLR)
RP1_6: RP1.6(+5V) U1E.1(1A)
RP1_8: RP1.8(+5V) U1E.5(2B) U1E.9(3A)
RP1_11: RP1.11(+5V) U1C.1(U-D) U1D.6(G1)
SEG1: U4E.6(Q2) U7C.5(2B)
SEG2: U4E.7(Q3) U7C.9(3A)
SN: R8.1 U6C.14(D7)
SPIO: U2C.13(1E) U3B.6(1Q) U6A.9(3B)
TD0: U8A.14(VO1) U8B.5(A1) U11B.2(A1)
TD1: U8A.13(VO2) U8B.3(A2) U11B.3(A2)
TD2: U8A.12(VO3) U8B.14(A3) U11B.4(A3)
TD3: U8A.11(VO4) U8B.12(A4) U11B.5(A4)
TD4: U9A.14(VO1) U9B.5(A1) U11B.6(A5)
TD5: U9A.13(VO2) U9B.3(A2) U11B.7(A6)
TD6: U9A.12(VO3) U9B.14(A3) U11B.8(A7)
TD7: U9A.11(VO4) U9B.12(A4) U11B.9(A8)
U1A_2: U1A.2(B1) U1B.9(4A) U1C.11(QD) U3A.3(1K) U4A.12(4A) U6B.11(G) U7B.1(1ACLK) U11E.3(1D)
U1A_3: U1A.3(Y1) U3C.5(1PR)
U1B_2: U1B.2(/1Y) U3C.2(1J)
U1B_4: U1B.4(/2Y) U3C.14(2J)
U1B_8: U1B.8(/4Y) U2B.3(1K) U5A.3(2A) U6A.5(2A)
U1E_2: Q2.3 R13.2 U1E.2(1B)
U1E_12: U1E.12(4A) U1E.13(4B) U5B.4(2Y) U7A.9(3A) U7A.12(4A)
U2E_5: U2E.5(3A) U3A.6(1Q)
U2E_9: U2E.9(4A) U13F.7(Y7) U14F.15(2G)
U3D_11: U1B.10(/5Y) U3D.11(2E)
U4D_6: U2D.9(A3) U4D.6(2Y) U15F.2(1B)
U5A_2: U2D.3(Y1) U5A.2(1B)
U5A_6: U3C.11(2PR) U5A.6(2Y)
U5A_13: U4D.3(1Y) U5A.13(1C)
U5B_1: U3D.4(2A) U5A.1(1A) U5B.1(1Y)
U5D_13: U2D.6(Y2) U5D.13(2K)
U6A_4: U4B.14(2J) U6A.4(2Y)
U6A_8: U3A.7(/1Q) U6A.8(3A)
U6D_1: U6B.15(6Q) U6D.1(1A)
U6D_2: U5E.9(2QC) U6C.19(A7) U6D.2(1B) U7F.6(INH) U8F.6(INH)
U7A_10: U4E.4(Q0) U7A.10(3B)
U7A_13: U4E.5(Q1) U7A.13(4B)
U7C_11: U5A.4(2B) U7C.11(/4Y)
U8C_2: U5E.3(1QA) U6C.18(A6) U7E.3(1C3) U8C.2(1A1)
U8C_4: U5E.4(1QB) U7E.13(2C3) U8C.4(1A2)
UA1: U13A.29(A1) U13D.10(A0) U14D.10(A0) U15C.17(2A4)
UA2: U13A.30(A2) U13D.9(A1) U14D.9(A1) U15C.15(2A3)
UA3: U6D.13(4B) U13A.31(A3) U13D.8(A2) U14D.8(A2) U15C.13(2A2)
UA4: U13A.32(A4) U13D.7(A3) U14D.7(A3) U15C.11(2A1)
UA5: U13A.33(A5) U13D.6(A4) U14D.6(A4) U15C.8(1A4)
UA6: U13A.34(A6) U13D.5(A5) U14D.5(A5) U15C.6(1A3)
UA7: U13A.35(A7) U13D.4(A6) U14D.4(A6) U15C.4(1A2)
UA8: U13A.36(A8) U13D.3(A7) U14D.3(A7) U15C.2(1A1)
UA9: U8B.6(B1) U13A.37(A9) U13D.25(A8) U14D.25(A8)
UA10: U8B.2(B2) U13A.38(A10) U13D.24(A9) U14D.24(A9)
UA11: U8B.15(B3) U13A.39(A11) U13D.21(A10) U14D.21(A10)
UA12: J1.2 U8B.11(B4) U13A.40(A12) U13D.23(A11) U14D.23(A11)
UA13: U9B.6(B1) U13A.41(A13) U13D.2(A12) U14D.2(A12)
UA14: U5B.12(4B) U9B.2(B2) U13A.42(A14)
UA15: U9B.15(B3) U13A.43(A15) U14F.2(1A)
UA16: U9B.11(B4) U13A.44(A16) U14F.3(1B)
UA17: U8A.17(A7) U9A.17(A7) U10A.17(A7) U13A.45(A17)
UA18: U8A.16(A8) U9A.16(A8) U10A.16(A8) U13A.46(A18)
UA19: U8A.15(A9) U9A.15(A9) U10A.15(A9) U13A.47(A19)
UA20: U8A.7(A2) U9A.7(A2) U10A.7(A2) U13A.48(A20)
UA21: U8A.1(A6) U9A.1(A6) U10A.1(A6) U13A.50(A21)
UA22: U8A.2(A5) U9A.2(A5) U10A.2(A5) U13A.51(A22)
UA23: U8A.3(A4) U9A.3(A4) U10A.3(A4) U13A.52(A23)
UD0: U11B.18(B1) U11C.7(3D) U13A.5(D0) U14D.11(O0) U15E.18(B1)
UD1: U11B.17(B2) U11C.8(4D) U13A.4(D1) U14D.12(O1) U15E.17(B2)
UD2: U11B.16(B3) U11C.13(5D) U13A.3(D2) U14D.13(O2) U15E.16(B3)
UD3: U11B.15(B4) U11C.14(6D) U13A.2(D3) U14D.15(O3) U15E.15(B4)
UD4: U11B.14(B5) U11C.17(7D) U13A.1(D4) U14D.16(O4) U15E.14(B5)
UD5: U11B.13(B6) U11C.18(8D) U13A.64(D5) U14D.17(O5) U15E.13(B6)
UD6: U11B.12(B7) U13A.63(D6) U14D.18(O6) U15E.12(B7)
UD7: U11B.11(B8) U13A.62(D7) U14D.19(O7) U15E.11(B8)
UD8: U11A.18(B1) U13A.61(D8) U13D.11(O0) U14E.18(B1)
UD9: U11A.17(B2) U13A.60(D9) U13D.12(O1) U14E.17(B2)
UD10: U11A.16(B3) U13A.59(D10) U13D.13(O2) U14E.16(B3)
UD11: U11A.15(B4) U13A.58(D11) U13D.15(O3) U14E.15(B4)
UD12: U13A.57(D12) U13D.16(O4) U14E.14(B5)
UD13: U13A.56(D13) U13D.17(O5) U14E.13(B6)
UD14: U11A.12(B7) U13A.55(D14) U13D.18(O6) U14E.12(B7)
UD15: U11A.11(B8) U13A.54(D15) U13D.19(O7) U14E.11(B8)
VA1: U6F.3(1QA) U7E.5(1C1)
VA2: U6F.4(1QB) U7E.11(2C1)
VA3: U6E.5(1C1) U6F.5(1QC)
VA4: U6E.11(2C1) U6F.6(1QD) U6F.13(2ACLK)
VA5: U5F.5(1C1) U6F.11(2QA)
VA6: U5F.11(2C1) U6F.10(2QB)
VA7: U6F.9(2QC) U8E.5(1C1)
VA8: U4A.1(1A) U4D.4(2A) U5E.1(1ACLK) U6F.8(2QD) U8E.11(2C1)
VA9B: CN1.70(VA9B) U8C.18(1Y1)
VA10B: CN1.69(VA10B) U8C.16(1Y2)
VA11: U4D.5(2B) U5E.5(1QC) U6E.3(1C3)
VA12: U5E.6(1QD) U5E.13(2ACLK) U6E.13(2C3)
VA13: U5E.11(2QA) U5F.3(1C3)
VA14: U5E.10(2QB) U5F.13(2C3)
VID: CN1.115(VID) U4D.8(3Y) U9E.11(2A1)
Net-(C9-1): C9.1 R3.1 U2E.12(6Y) U15B.8(TR2) U15B.12(TH2)
Net-(C19-2): C19.2 R4.2 R5.2 U5C.1(1R)
Net-(C21-2): C21.2 R6.2 R7.2 U5C.10(3R)
Net-(C39-1): C39.1 Q1.2 R15.2 R16.2 R17.1
Net-(L1-1): L1.1 Q1.3 Y1.2
Net-(Q1-1): Q1.1 Q2.1 R14.1
Net-(Q2-2): Q2.2 R15.1 Y1.1
Net-(R8-2): R8.2 U11A.9(A8)
Net-(R9-2): R9.2 U10C.10(3B) U13A.28(FC0)
Net-(R10-2): R10.2 U4D.11(4Y)
Net-(RP2-11): RP2.11(+5V) U2E.2(1Y) U2E.3(2A) U13A.18(RESET)
Net-(U1A-6): U1A.6(Y2) U5B.11(4A)
Net-(U1A-8): U1A.8(Y3) U1A.12(A4) U1A.13(B4)
Net-(U1A-9): U1A.9(A3) U1A.10(B3) U1A.11(Y4)
Net-(U1B-6): U1B.6(/3Y) U2D.12(A4)
Net-(U1C-12): U1C.12(QC) U1D.3(C)
Net-(U1C-14): U1C.14(QA) U1D.1(A)
Net-(U1C-15): U1C.15(RP0) U2C.10(2D)
Net-(U1E-3): U1E.3(/1Y) U1E.4(2A) U1E.10(3B)
Net-(U2B-2): U2B.2(1J) U2B.14(2J) U2C.6(2Y)
Net-(U2C-5): U2C.5(1Y) U3B.14(2J)
Net-(U2C-11): U2C.11(2E) U3B.10(2Q)
Net-(U2D-11): U2D.11(Y4) U4F.2(1G) U4F.14(2G)
Net-(U3A-10): U3A.10(2Q) U13F.6(G1)
Net-(U3B-2): U3B.2(1J) U3D.6(2Y)
Net-(U3D-5): U3D.5(1Y) U4B.2(1J)
Net-(U3E-5): U3E.5(1PR) U4A.11(4Y)
Net-(U3E-6): U3E.6(1Q) U6F.1(1ACLK) U7F.15(LD) U8F.15(LD)
Net-(U3E-10): U3E.10(2Q) U4D.9(3A)
Net-(U3E-13): U3E.13(2K) U3E.14(2J) U7F.13(SO)
Net-(U4A-2): U4A.2(1B) U6C.9(D3)
Net-(U4A-3): U4A.3(1Y) U6B.8(4D)
Net-(U4A-5): U4A.5(2B) U6B.9(4Q)
Net-(U4A-6): U4A.6(2Y) U5E.2(1CLR) U5E.12(2CLR) U6F.2(1CLR) U6F.12(2CLR)
Net-(U4A-13): U4A.13(4B) U6B.6(3Q)
Net-(U4E-14): U4E.14(G) U14F.12(2Y0)
Net-(U5A-5): U5A.5(2C) U5A.12(1Y)
Net-(U5B-10): U5B.10(3Y) U8B.7(C0)
Net-(U5B-13): U5B.13(4Y) U10A.8(CS)
Net-(U5C-4): U5C.4(1Q) U9E.2(1A1) U10C.2(1B) U10C.5(2C)
Net-(U5C-9): U5C.9(3Q) U9E.4(1A2) U10C.1(1A) U10C.4(2B)
Net-(U5C-13): U5C.13(4Q) U9E.8(1A4)
Net-(U5D-6): U5D.6(1Q) U11A.19(G) U11B.19(G)
Net-(U5D-10): U5D.10(2Q) U8A.10(WE) U9A.10(WE) U10A.10(WE)
Net-(U6B-2): U6B.2(1Q) U7B.2(1CLR) U7B.12(2CLR)
Net-(U6B-3): U6B.3(1D) U6C.6(D0)
Net-(U6B-4): U6B.4(2D) U6C.7(D1)
Net-(U6B-7): U6B.7(3D) U6C.8(D2)
Net-(U6B-13): U6B.13(5D) U6C.11(D4)
Net-(U6B-14): U6B.14(6D) U6C.12(D5)
Net-(U6B-17): U6B.17(7D) U6B.18(8D) U6C.13(D6)
Net-(U6C-1): U6C.1(A0) U7B.3(1QA)
Net-(U6C-2): U6C.2(A1) U7B.4(1QB)
Net-(U6C-3): U6C.3(A2) U7B.5(1QC)
Net-(U6C-4): U6C.4(A3) U7B.6(1QD) U7B.13(2ACLK)
Net-(U6C-5): U6C.5(A4) U7B.11(2QA)
Net-(U6C-17): U6C.17(A5) U7B.10(2QB)
Net-(U6D-6): U6D.6(/2Y) U7D.1(/OE)
Net-(U6D-10): U6D.10(3B) U6D.11(/4Y)
Net-(U7A-1): U7A.1(1A) U7A.2(1B) U15B.5(Q1)
Net-(U7C-3): U7C.3(/1Y) U7C.4(2A) U7C.10(3B)
Net-(U7F-1): U7F.1(SI) U8F.13(SO)
Net-(U8B-1): U8B.1(S2) U11D.14(6D)
Net-(U8B-4): U8B.4(S1) U11D.13(5D)
Net-(U8B-9): U8B.9(C4) U9B.7(C0)
Net-(U8B-10): U8B.10(S4) U11D.18(8D)
Net-(U8B-13): U8B.13(S3) U11D.17(7D)
Net-(U8C-6): U8C.6(1A3) U13A.20(E)
Net-(U8C-8): U8C.8(1A4) U13A.19(VMA)
Net-(U8C-11): U8C.11(2A1) U13A.9(READ)
Net-(U8C-15): U8C.15(2A3) U13A.8(LDS)
Net-(U8C-17): U8C.17(2A4) U13A.7(UDS)
Net-(U9B-1): U9B.1(S2) U9D.4(2D) U11D.4(2D)
Net-(U9B-4): U9B.4(S1) U9D.3(1D) U11D.3(1D)
Net-(U9B-10): U9B.10(S4) U9D.8(4D) U11D.8(4D)
Net-(U9B-13): U9B.13(S3) U9D.7(3D) U11D.7(3D)
Net-(U9D-1): U9D.1(OE) U15F.8(/3Y)
Net-(U9D-13): U9D.13(5D) U10B.4(S1)
Net-(U9D-14): U9D.14(6D) U10B.1(S2)
Net-(U9D-17): U9D.17(7D) U10B.13(S3)
Net-(U9D-18): U9D.18(8D) U10B.10(S4)
Net-(U10C-6): U10C.6(2Y) U11E.11(G) U13E.11(G)
Net-(U10C-9): U10C.9(3A) U13A.27(FC1)
Net-(U11C-11): U11C.11(G) U15F.11(/4Y)
Net-(U12F-6): U12F.6(A2) U13A.23(IPL2)
Net-(U12F-7): U12F.7(A1) U13A.24(IPL1)
Net-(U12F-9): U12F.9(A0) U13A.25(IPL0)

Not connected (* = marked no-connect by the designer): U2A 1* 2* 3* 4* 5* 6* 7* 8* 9* 10* 11* 12* 13* 14* 15* 16*; U3A 9(/2Q)*; U3E 7(/1Q)* 9(/2Q)*; U3F 1* 2* 3* 4* 5* 6* 7* 8* 9* 10* 11* 12* 13* 14* 15* 16* 17* 18* 19* 20*; U4A 8(3Y)*; U5D 7(/1Q)* 9(/2Q)*; U5E 8(2QD)*; U6B 19(8Q)*; U7A 4(2A) 5(2B) 6(2Y); U7B 8(2QD)* 9(2QC)*; U10B 9(C4)*; U11A 6(A5)* 7(A6)* 8(A7)* 13(B6)* 14(B5)*; U11C 2(1Q)* 5(2Q)*; U14F 6(1Y2)* 7(1Y3)*; U15B 1(D1)* 3(C1)* 11(C2)* 13(D2)*

## Notes on the sheets
sheet 5
- BERR
- SPIO
- CAS
- RAS
- CMUX
- IOCY
- MALE
- CPUC1
